# Altium schematic sheet PowerReg.SchDoc
size A; SheetNumber: 4; SheetTotal: 4
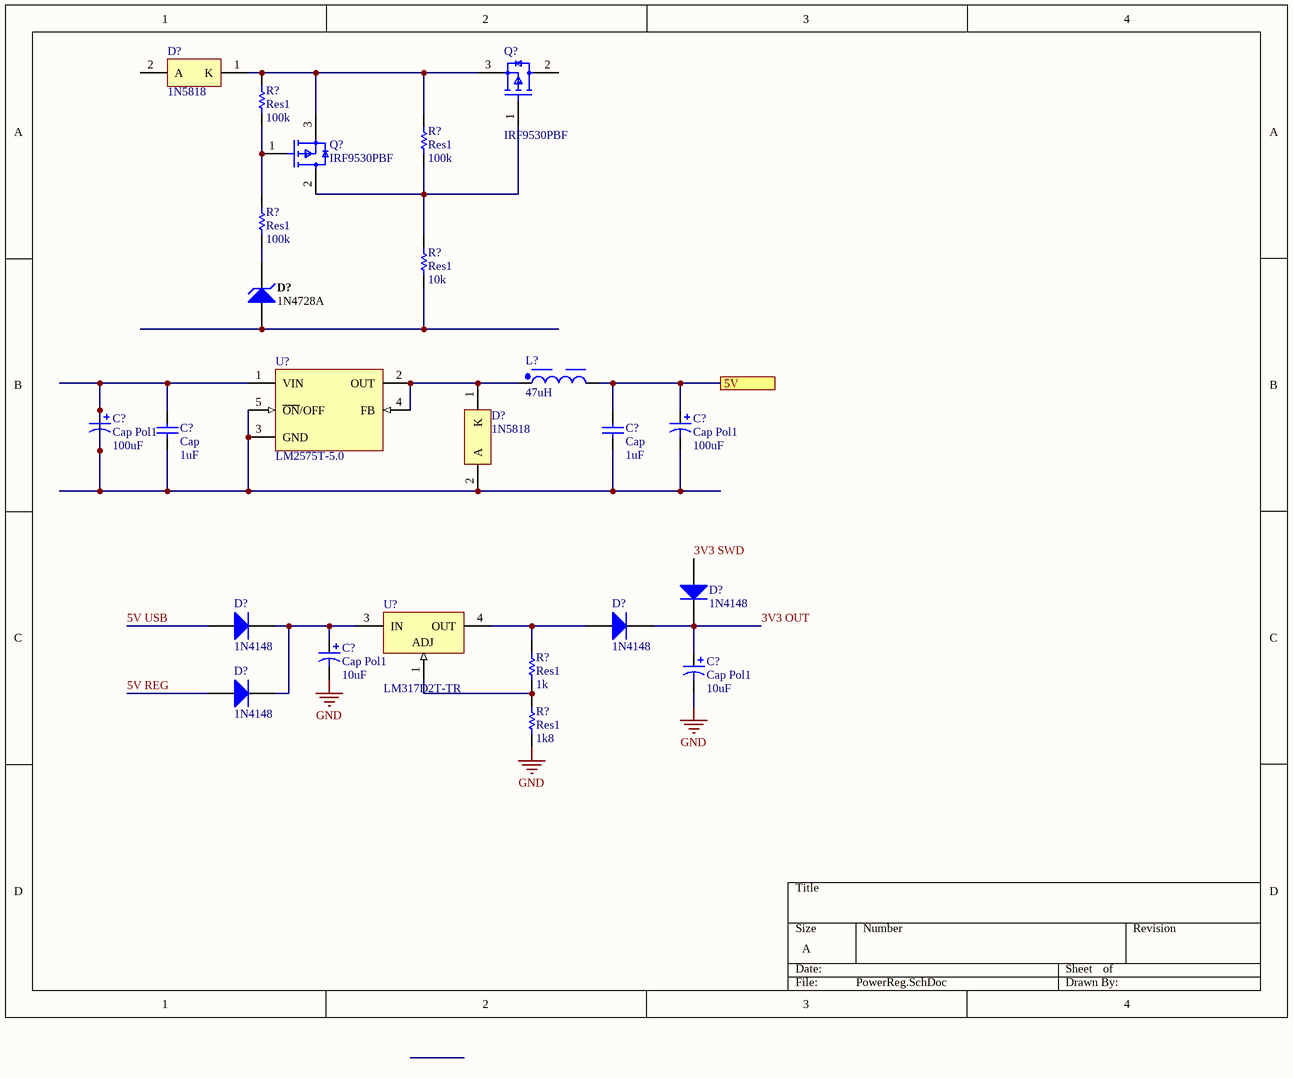
[diagram p0: PowerReg.SchDoc]

## Parts
(Parts that share a designator on the sheet are numbered #1, #2 ... from top to bottom, then left to right.)
C?#1  Cap Pol1  value 100uF  [RB7.6-15]
C?#2  Cap Pol1  value 100uF  [RB7.6-15]
C?#3  Cap  value 1uF  [RAD-0.3]
C?#4  Cap  value 1uF  [RAD-0.3]
C?#5  Cap Pol1  value 10uF  [RB7.6-15]
C?#6  Cap Pol1  value 10uF  [RB7.6-15]
D?#1  1N5818  [ONSC-AXIAL_LEAD-2-59-10_P]
D?#2  1N4728A  [FAIR-DO-41-2_V]
D?#3  1N5818  [ONSC-AXIAL_LEAD-2-59-10_P]
D?#4  1N4148  [NXP-SOD27-2_V]
D?#5  1N4148  [NXP-SOD27-2_V]
D?#6  1N4148  [NXP-SOD27-2_V]
D?#7  1N4148  [NXP-SOD27-2_V]
L?  47uH  [WE-TIS_1111]
Q?#1  IRF9530PBF  [FP-X15-0364-MFG]
Q?#2  IRF9530PBF  [FP-X15-0364-MFG]
R?#1  Res1  value 100k  [AXIAL-0.3]
R?#2  Res1  value 100k  [AXIAL-0.3]
R?#3  Res1  value 100k  [AXIAL-0.3]
R?#4  Res1  value 10k  [AXIAL-0.3]
R?#5  Res1  value 1k  [AXIAL-0.3]
R?#6  Res1  value 1k8  [AXIAL-0.3]
U?#1  LM2575T-5.0  [KC0005A]
U?#2  LM317D2T-TR  [TO-263_N]

## Ports
5V

## Nets
GND: C?#5.2 C?#6.2 R?#6.1
3V3 OUT: C?#6.1 D?#4.2(K) D?#6.2(K)
3V3 SWD: D?#4.1(A)
5V: C?#2.1 C?#4.2 L?.2 ; port 5V
5V REG: D?#7.1(A)
5V USB: D?#5.1(A)
NetC?#1_1: C?#1.1 C?#1.2 C?#2.2 C?#3.1 C?#3.2 C?#4.1 D?#3.2(A) U?#1.1(VIN) U?#1.3(GND) U?#1.5(~{ON}/OFF)
NetC?#5_1: C?#5.1 D?#5.2(K) D?#7.2(K) U?#2.3(IN)
NetD?#1_1: D?#1.1(K) Q?#1.3(S) Q?#2.3(S) R?#1.2 R?#2.2
NetD?#2_1: D?#2.1(A) R?#4.1
NetD?#2_2: D?#2.2(K) R?#3.1
NetD?#3_1: D?#3.1(K) L?.1 U?#1.2(OUT) U?#1.4(FB)
NetD?#6_1: D?#6.1(A) R?#5.2 U?#2.4(OUT)
NetQ?#1_1: Q?#1.1(G) Q?#2.2(D) R?#2.1 R?#4.2
NetQ?#2_1: Q?#2.1(G) R?#1.1 R?#3.2
NetR?#5_1: R?#5.1 R?#6.2 U?#2.1(ADJ)

Not connected (* = marked no-connect by the designer): D?#1 2(A); Q?#1 2(D)

## Library data of the parts
C?#1 C?#2 C?#5 C?#6 = Cap Pol1: Polarized Capacitor (Radial); Published: 8-Jun-2000; LatestRevisionDate: 17-Jul-2002; LatestRevisionNote: Re-released for DXP Platform.; PackageReference: RB7.6-15; Publisher: Altium Limited; PackageDescription: Polarized Capacitor (Radial); 2 Leads
C?#3 C?#4 = Cap: Capacitor; Published: 8-Jun-2000; LatestRevisionDate: 17-Jul-2002; LatestRevisionNote: Re-released for DXP Platform.; PackageReference: RAD-0.3; Publisher: Altium Limited; PackageDescription: Radial Cap, Thru-Hole; 2 Leads; 0.3 in Pin Spacing
D?#1 D?#3 = CMP-1055-00034-1: Rectifier, 2-Pin Axial_Lead, Pb-Free, Bulk Bag; Manufacturer: On Semiconductor; IFSM Max (A): 25; Note1: 0; Configuration: Single; ComponentLink1Description: Manufacturer URL; ComponentLink3URL: http://www.onsemi.cn/pub_link/Collateral/59-10.PDF; PackageVersion: Rev. U, 02/2005; RoHS: TRUE; PartNumber: 1N5818; ComponentLink1URL: http://www.onsemi.com/; ComponentLink2URL: http://www.onsemi.cn/pub_link/Collateral/1N5817-D.PDF; PackageDescription: 2-Pin, Axial Lead, Diameter 2.35 mm; Packing: Bulk Bag; ComponentLink2Description: Datasheet; DatasheetVersion: Rev. 10; PackageReference: AXIAL_LEAD-2-59-10; Mounting Technology: Through Hole; ComponentLink3Description: Package Specification
D?#2 = CMP-0892-00028-1: Zener Diode, 3.3V, 1W, 5%, -65 to 200 degC, 2-Pin DO-41, Body 2.72 x 5.2 mm, RoHS; Manufacturer: Fairchild Semiconductor; PD (W): 1; VZ (Max.) (V): 3.465; IR (uA): 100; ZZ (Max) (ohm): 10; Test Current IZ (mA): 76; VZ (Min.) (V): 3.135; DatasheetVersion: Rev. H3; Tolerance: 5%; ComponentLink3URL: http://www.fairchildsemi.com/dwg/DO/DO41A.pdf; ComponentLink2Description: Datasheet; PackageDescription: 2-Pin Axial leaded, Body 2.72 x 5.2 mm, Lead Spread 25.4 mm; PartNumber: 1N4728A; Operating and Storage Temperature Range: -65 to 200 degC; Mounting Technology: Through Hole; ComponentLink3Description: Package Specification; PackageReference: DO-41-2; ComponentLink1URL: http://www.fairchildsemi.com/; RoHS: TRUE; ComponentLink1Description: Manufacturer URL; ComponentLink2URL: http://www.fairchildsemi.com/ds/1N/1N4744A.pdf; PackageVersion: Rev. 2
D?#4-D?#7 = CMP-0648-00002-1: High-speed Diode, 100 V, 450 mA, 2-Pin SOD27, RoHS; Manufacturer: NXP Semiconductors; Configuration: Single; IR (VR: 20 V)=25 nA; IFRM: 450 mA; IFSM: 4 A Max.; Trr: 4 ns Max.; Cd: 4 pF Max.; VR: 100 V Max.; VF (IF: 10 mA)=1 V; IF: 200 mA Max.; ComponentLink1Description: Manufacturer URL; RoHS: TRUE; ComponentLink1URL: http://www.nxp.com/; ComponentLink3Description: Package Specification; DatasheetVersion: Aug-04; ComponentLink2Description: Datasheet; PackageVersion: Aug-04; PackageReference: SOD27; ComponentLink3URL: http://www.nxp.com/documents/data_sheet/1N4148_1N4448.pdf; Mounting Technology: Through Hole; ComponentLink2URL: http://www.nxp.com/documents/data_sheet/1N4148_1N4448.pdf; PartNumber: 1N4148; PackageDescription: 2-Pin Hermetically Sealed Glass Package, Axial Leaded, Dia 1.85 mm, Body Length 4.25 mm, Lead Spread 25.4 mm
L? = CMP-1406-00025-2: NexarPartId: 22866550; Series Resistance: 9mΩ; Inductance Tolerance: 20%; Shielding: Shielded; Inductance: 3.3µH; Current Rating: 7.5A; Frequency: 58MHz; Lead Diameter: 650µm; Saturation Current: 8A; Test Frequency: 1kHz; Core Material: Ferrite; Min Operating Temperature: -40°C; Max Operating Temperature: 125°C; Length: 11mm; Height: 11.5mm; Case/Package: Radial; Termination: Radial; Mount: Radial, Through Hole; RoHS: Compliant; Max DC Current: 7.5A; REACH SVHC: Unknown; Ambient Temperature Range High: 85°C; DC Resistance (DCR): 9mΩ; Self Resonant Frequency: 58MHz; RMS Current (Irms): 7.5A; Features: Shielded; Diameter: 11mm; Tolerance: 20%; Ambient Temperature Range Low: -40°C; Composition: Wirewound; Number of Pins: 2; Width: 11mm; Lead Pitch: 5mm
Q?#1 Q?#2 = CMP-02550-000233-1: MOSFET P-CH 100V 12A TO-220AB; Drain to Source Breakdown Voltage: -100V; On-State Resistance: 300mR; Gate to Source Voltage (Vgs): 20V; Recovery Time: 240ns; Power Dissipation: 88W; Threshold Voltage: -4V; Number of Channels: 1; Current Rating: -12A; Fall Time: 39ns; Polarity: P-CHANNEL; Turn-On Delay Time: 12ns; Element Configuration: Single; Input Capacitance: 860pF; Rise Time: 52ns; Turn-Off Delay Time: 31ns; Polarization: P; Lead Free: Lead Free; RoHS Compliant: Yes; Radiation Hardening: No; Width: 4.7mm; Drain to Source Resistance: 300mR; Package Quantity: 50; Height: 9.01mm; Length: 10.41mm; Rds On Max: 300mR; Min Operating Temperature: -55°C; Case/Package: TO-220AB; Continuous Drain Current (ID): 12A; Number of Pins: 3; Weight: 0.211644oz; Max Operating Temperature: 175°C; Series: -; Max Power Dissipation: 88W; Voltage Rating (DC): -100V; Mount: Through Hole; Packaging: Rail/Tube; Number of Elements: 1; Drain-source On Resistance-Max: 300mR; Drain to Source Voltage (Vdss): 100V
R?#1-R?#6 = Res1: Resistor; Published: 8-Jun-2000; LatestRevisionDate: 17-Jul-2002; LatestRevisionNote: Re-released for DXP Platform.; PackageReference: AXIAL-0.3; Publisher: Altium Limited; PackageDescription: Axial Device, Thru-Hole; 2 Leads; 0.3 in Pin Spacing
U?#1 = CMP-0069-02026-3: SIMPLE SWITCHER® 1A Step-Down Voltage Regulator, 5-pin TO-220; Manufacturer: Texas Instruments; PackageTopMarking: NSUZXYTTE#*LM2575T*-5.0 P+; PowerWise: N; RoHS: N; Code_JEDEC: TO-220-AB; ComponentLink1Description: Datasheet URL; CompType: Switcher; PackageReference: KC0005A; PinCount: 5; PackageDescription: TO-220, Molded, 5 Lead, Straight; ComponentLink1URL: http://www.ti.com/general/docs/lit/getliterature.tsp?genericPartNumber=LM2575-N&fileType=pdf
U?#2 = CMP-0244-00094-1: 1.5A, 1.2V to 37V Adjustable Voltage Regulator, 3-Pin D2PAK, Tape and Reel; DatasheetVersion: 1/11/2011; PackageVersion: 2011; PackageDescription: 3-Pin Transistor Outline Package 2.54 mm Pitch, 15.4 mm Lead Span (D2PAK); ComponentLink2URL: http://www.st.com/internet/com/TECHNICAL_RESOURCES/TECHNICAL_LITERATURE/DATASHEET/CD00000455.pdf; PackageReference: TO-263; ComponentLink1Description: Manufacturer URL; ComponentLink2Description: Datasheet; ComponentLink1URL: http://www.st.com